# Altium schematic sheet Single_5x7.SCHDOC
size A4
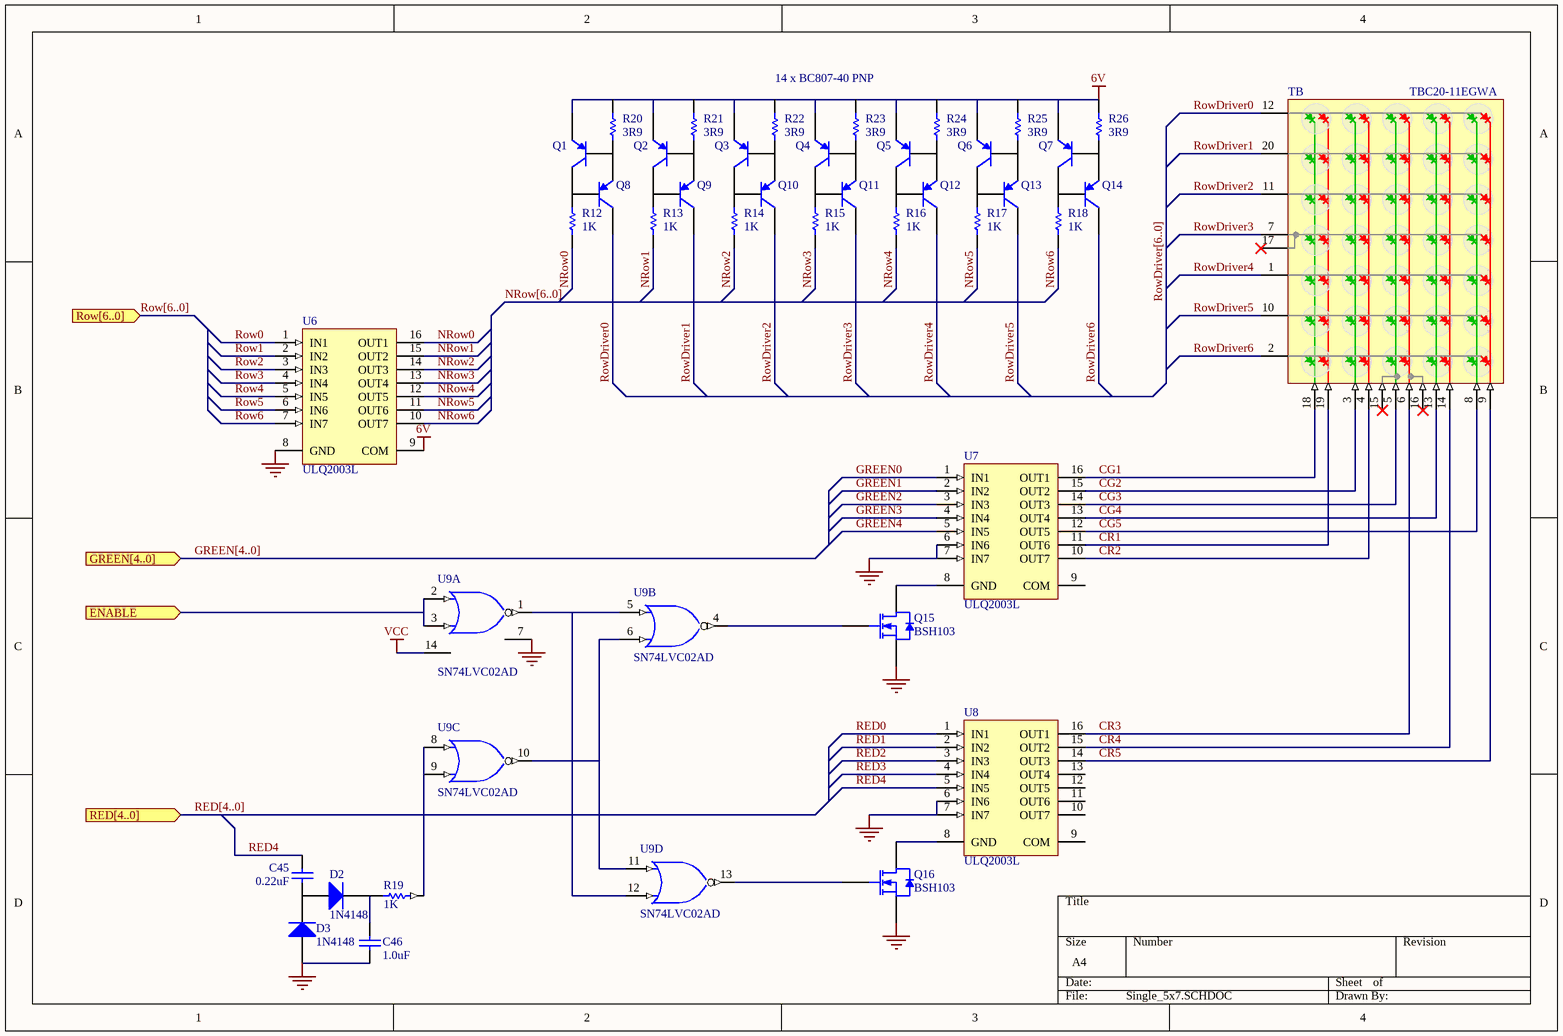
[diagram p0: Single_5x7.SCHDOC]

## Parts
C45  0.22uF  [C3216-1206]
C46  1.0uF  [C3216-1206]
D2  1N4148  [DSO-C2/X3.3]
D3  1N4148  [DSO-C2/X3.3]
Q1  BC807-40  [SOT23]  (value not drawn)
Q2  BC807-40  [SOT23]  (value not drawn)
Q3  BC807-40  [SOT23]  (value not drawn)
Q4  BC807-40  [SOT23]  (value not drawn)
Q5  BC807-40  [SOT23]  (value not drawn)
Q6  BC807-40  [SOT23]  (value not drawn)
Q7  BC807-40  [SOT23]  (value not drawn)
Q8  BC807-40  [SOT23]  (value not drawn)
Q9  BC807-40  [SOT23]  (value not drawn)
Q10  BC807-40  [SOT23]  (value not drawn)
Q11  BC807-40  [SOT23]  (value not drawn)
Q12  BC807-40  [SOT23]  (value not drawn)
Q13  BC807-40  [SOT23]  (value not drawn)
Q14  BC807-40  [SOT23]  (value not drawn)
Q15  BSH103  [SOT23]
Q16  BSH103  [SOT23]
R12  1K  [CC2012-0805]
R13  1K  [CC2012-0805]
R14  1K  [CC2012-0805]
R15  1K  [CC2012-0805]
R16  1K  [CC2012-0805]
R17  1K  [CC2012-0805]
R18  1K  [CC2012-0805]
R19  1K  [CC2012-0805]
R20  3R9  [CC2012-0805]
R21  3R9  [CC2012-0805]
R22  3R9  [CC2012-0805]
R23  3R9  [CC2012-0805]
R24  3R9  [CC2012-0805]
R25  3R9  [CC2012-0805]
R26  3R9  [CC2012-0805]
TB  TBC20-11EGWA  [TBC20-11EGWA]
U6  ULQ2003L  [L16]
U7  ULQ2003L  [L16]
U8  ULQ2003L  [L16]
U9  SN74LVC02AD  [D014]  (parts A,B,C,D of 4)

## Ports
ENABLE (in), GREEN[4..0] (in), RED[4..0] (in), Row[6..0] (in)

## Nets
6V: Q1.2(E) Q2.2(E) Q3.2(E) Q4.2(E) Q5.2(E) Q6.2(E) Q7.2(E) R20.1 R21.1 R22.1 R23.1 R24.1 R25.1 R26.1 U6.9(COM)
GND: C46.1 D3.1(A) Q15.2(S) Q16.2(S) U6.8(GND) U7.6(IN6) U7.7(IN7) U8.6(IN6) U8.7(IN7) U9.7(GND)
VCC: U9.14(VCC)
CG1: TB.18(C1G) U7.16(OUT1)
CG2: TB.3(C2) U7.15(OUT2)
CG3: TB.5(C3G) U7.14(OUT3)
CG4: TB.13(C4G) U7.13(OUT4)
CG5: TB.8(C5G) U7.12(OUT5)
CR1: TB.19(C1R) U7.11(OUT6)
CR2: TB.4(C2R) U7.10(OUT7)
CR3: TB.6(C3R) U8.16(OUT1)
CR4: TB.14(C4R) U8.15(OUT2)
CR5: TB.9(C5R) U8.14(OUT3)
ENABLE: U9.2(A) U9.3(B) ; port ENABLE
GREEN0: U7.1(IN1)
GREEN1: U7.2(IN2)
GREEN2: U7.3(IN3)
GREEN3: U7.4(IN4)
GREEN4: U7.5(IN5)
NRow0: R12.2 U6.16(OUT1)
NRow1: R13.2 U6.15(OUT2)
NRow2: R14.2 U6.14(OUT3)
NRow3: R15.2 U6.13(OUT4)
NRow4: R16.2 U6.12(OUT5)
NRow5: R17.2 U6.11(OUT6)
NRow6: R18.2 U6.10(OUT7)
RED0: U8.1(IN1)
RED1: U8.2(IN2)
RED2: U8.3(IN3)
RED3: U8.4(IN4)
RED4: C45.2 U8.5(IN5)
Row0: U6.1(IN1)
Row1: U6.2(IN2)
Row2: U6.3(IN3)
Row3: U6.4(IN4)
Row4: U6.5(IN5)
Row5: U6.6(IN6)
Row6: U6.7(IN7)
RowDriver0: Q8.3(C) TB.12(R1)
RowDriver1: Q9.3(C) TB.20(R2)
RowDriver2: Q10.3(C) TB.11(R3)
RowDriver3: Q11.3(C) TB.7(R4)
RowDriver4: Q12.3(C) TB.1(R5)
RowDriver5: Q13.3(C) TB.10(R6)
RowDriver6: Q14.3(C) TB.2(R7)
NetC45_1: C45.1 D2.1(A) D3.2(K)
NetC46_2: C46.2 D2.2(K) R19.1
NetQ1_1: Q1.1(B) Q8.2(E) R20.2
NetQ1_3: Q1.3(C) Q8.1(B) R12.1
NetQ2_1: Q2.1(B) Q9.2(E) R21.2
NetQ2_3: Q2.3(C) Q9.1(B) R13.1
NetQ3_1: Q3.1(B) Q10.2(E) R22.2
NetQ3_3: Q3.3(C) Q10.1(B) R14.1
NetQ4_1: Q4.1(B) Q11.2(E) R23.2
NetQ4_3: Q4.3(C) Q11.1(B) R15.1
NetQ5_1: Q5.1(B) Q12.2(E) R24.2
NetQ5_3: Q5.3(C) Q12.1(B) R16.1
NetQ6_1: Q6.1(B) Q13.2(E) R25.2
NetQ6_3: Q6.3(C) Q13.1(B) R17.1
NetQ7_1: Q7.1(B) Q14.2(E) R26.2
NetQ7_3: Q7.3(C) Q14.1(B) R18.1
NetQ15_1: Q15.1(G) U9.4(Y)
NetQ15_3: Q15.3(D) U7.8(GND)
NetQ16_1: Q16.1(G) U9.13(Y)
NetQ16_3: Q16.3(D) U8.8(GND)
NetR19_2: R19.2 U9.8(A) U9.9(B)
NetU9_1: U9.1(Y) U9.5(A) U9.12(B)
NetU9_6: U9.6(B) U9.10(Y) U9.11(A)

Not connected (* = marked no-connect by the designer): TB 15(C3G)* 16(C3R)* 17(R4)*; U7 9(COM); U8 9(COM) 10(OUT7) 11(OUT6) 12(OUT5) 13(OUT4)

## Buses and harness runs
bus GREEN[4..0] = port GREEN[4..0]
bus NRow[6..0]
bus RED[4..0] = port RED[4..0]
bus Row[6..0] = port Row[6..0]
bus RowDriver[6..0]

## Notes on the sheet
- 14 x BC807-40 PNP

## Library data of the parts
C45 C46 = CAP: Capacitor; Fitted: True
D2 D3 = Diode: Default Diode; Manufacturer: Generic Components; Class I: Discrete; Class II: Diode - Switching; Published: 8-Jun-2000; Revision: July-2002: Re-released for DXP Platform.; Publisher: Altium Limited
Q1-Q14 = BC807-40: PNP General-purpose Transistor; Manufacturer: Philips Semiconductors; Package Information: Latest Revision: May-1999; Published: 17-Sep-2003; Datasheet: Latest Revision: 8-Apr-1999; Package Reference: SOT23; Publisher: Altium Limited
Q15 Q16 = BSH103: N-channel Enhancement Mode MOSFET; Manufacturer: Philips Semiconductors; Package Information: Latest Revision: May-1999; Published: 17-Sep-2003; Datasheet: Latest Revision: 11-Feb-1998; Package Reference: SOT23; Publisher: Altium Limited
R12-R26 = RES: Resistor
U6-U8 = ULQ2003L: High-Voltage, High-Current Darlington Array; Manufacturer: Allegro; Code - JEDEC: MS-012-AC; Code - IPC: SO16; Published: 13-Oct-2000; Revision: 17-Jul-2002: Re-released for DXP Platform.; Datasheet: Latest Revision: 1998; Package Reference: L16; Publisher: Altium Limited
U9 = SN74LVC02AD: Quadruple 2-Input Positive-NOR Gate; Manufacturer: Texas Instruments; Package Information: Latest Revision: Jan-1998; Published: 8-Jun-2000; Revision: 17-Jul-2002: Re-released for DXP Platform.; Datasheet: Latest Revision: Oct-1998; Package Reference: D014; Publisher: Altium Limited